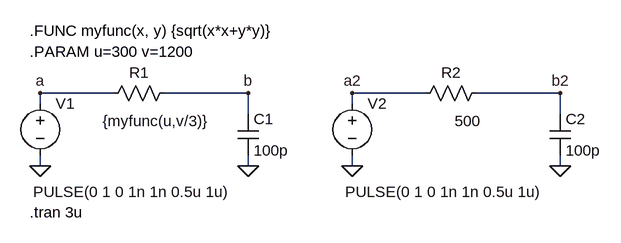
[diagram p0: schematic Fig_3-46_FUNC.asc]
Fig_3-46_FUNC.asc, the LTspice schematic file:
Version 4
SHEET 1 956 680
WIRE 192 112 80 112
WIRE 400 112 272 112
WIRE 672 112 560 112
WIRE 880 112 752 112
WIRE 80 128 80 112
WIRE 560 128 560 112
WIRE 400 144 400 112
WIRE 880 144 880 112
WIRE 80 224 80 208
WIRE 400 224 400 208
WIRE 560 224 560 208
WIRE 880 224 880 208
FLAG 80 224 0
FLAG 80 112 a
FLAG 400 224 0
FLAG 400 112 b
FLAG 560 224 0
FLAG 560 112 a2
FLAG 880 224 0
FLAG 880 112 b2
SYMBOL voltage 80 112 R0
WINDOW 3 -11 152 Left 2
WINDOW 123 0 0 Left 2
WINDOW 39 0 0 Left 2
SYMATTR Value PULSE(0 1 0 1n 1n 0.5u 1u)
SYMATTR InstName V1
SYMBOL res 176 128 R270
WINDOW 0 32 56 VTop 2
WINDOW 3 -11 82 VBottom 2
SYMATTR InstName R1
SYMATTR Value {myfunc(u,v/3)}
SYMBOL cap 384 144 R0
SYMATTR InstName C1
SYMATTR Value 100p
SYMBOL voltage 560 112 R0
WINDOW 3 -11 152 Left 2
WINDOW 123 0 0 Left 2
WINDOW 39 0 0 Left 2
SYMATTR Value PULSE(0 1 0 1n 1n 0.5u 1u)
SYMATTR InstName V2
SYMBOL res 656 128 R270
WINDOW 0 32 56 VTop 2
WINDOW 3 -11 82 VBottom 2
SYMATTR InstName R2
SYMATTR Value 500
SYMBOL cap 864 144 R0
SYMATTR InstName C2
SYMATTR Value 100p
TEXT 64 296 Left 2 !.tran 3u
TEXT 64 16 Left 2 !.FUNC myfunc(x, y) {sqrt(x*x+y*y)}
TEXT 64 48 Left 2 !.PARAM u=300 v=1200

The netlist it stands for:
* Fig_3-46_FUNC.asc
V1 a 0 PULSE(0 1 0 1n 1n 0.5u 1u)
R1 a b {myfunc(u,v/3)}
C1 b 0 100p
V2 a2 0 PULSE(0 1 0 1n 1n 0.5u 1u)
R2 a2 b2 500
C2 b2 0 100p
.tran 3u
.FUNC myfunc(x, y) {sqrt(x*x+y*y)}
.PARAM u=300 v=1200
.backanno
.end